# Altium schematic sheet [3]Regulator(+5V&3V3).SchDoc
size A; PageSetup: Record=PageOptions|CenterHorizontal=True|CenterVertical=True|PrintScale=1.00|XCorrection=1.00|YCorrection=1.00|PrintKind=1|BorderSize=5000000|LeftOffset=0|BottomOffset=0|Orientation=1|PaperLength=1000|PaperWidth=1000|Scale=100|PaperSource=7|PrintQuality=-3|MediaType=1|DitherType=10|PrintScaleMode=1|PaperKind=Letter|PaperIndex=1
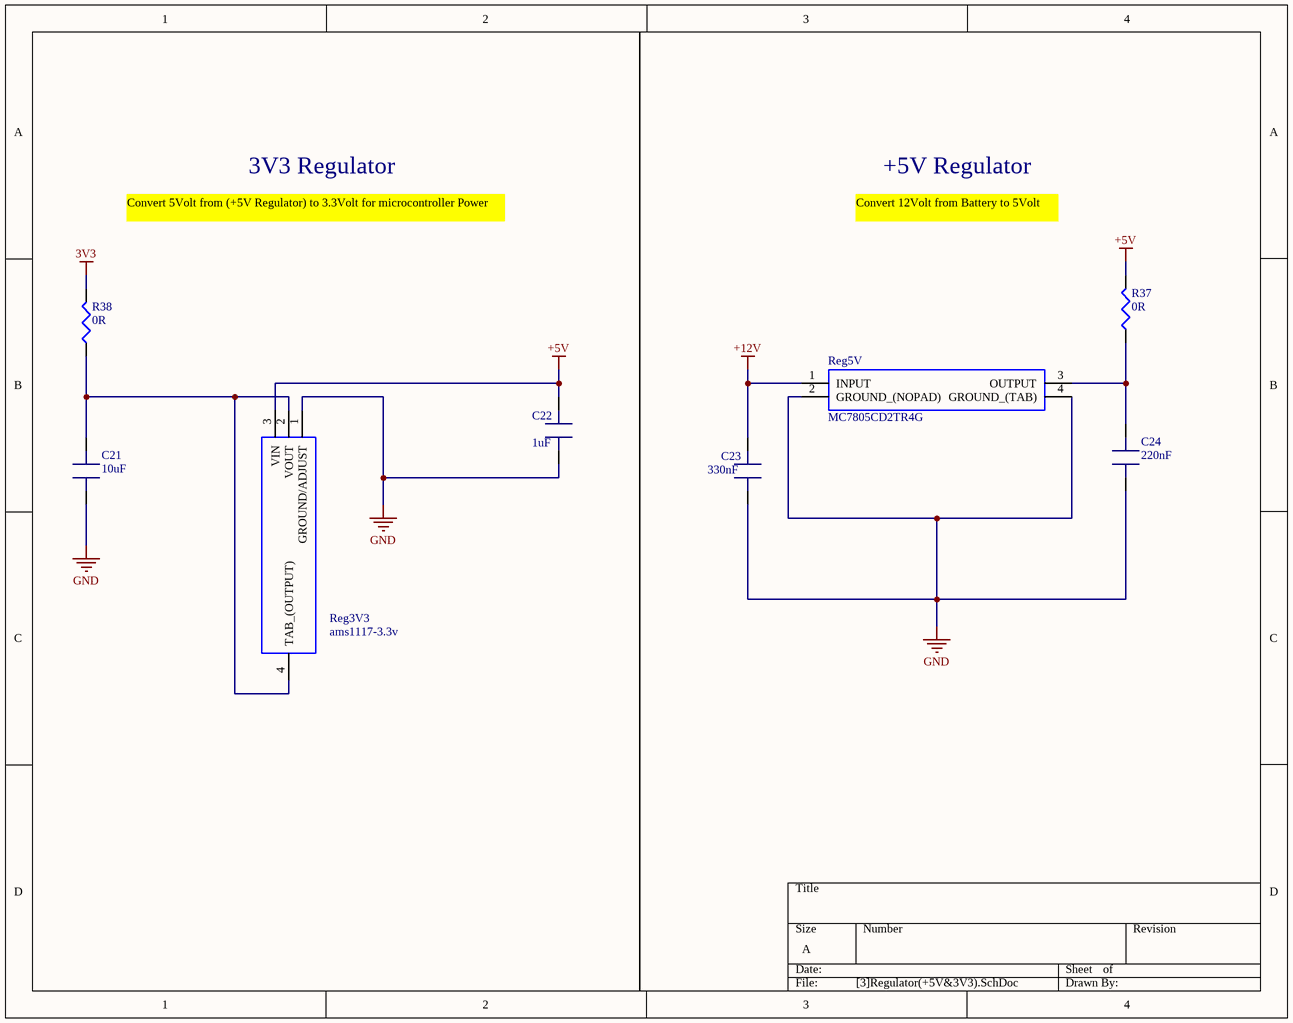
[diagram p0: [3]Regulator(+5V&3V3).SchDoc]

## Parts
C21  10uF  [cap_805]
C22  1uF  [cap_805]
C23  330nF  [cap_805]
C24  220nF  [cap_805]
R37  0R  [Res805]
R38  0R  [Res805]
Reg3V3  ams1117-3.3v  [SOT229P700X180-4N]
Reg5V  MC7805CD2TR4G  [TO254P1420X457-4N]

## Nets
3V3: R38.2
+5V: C22.2 R37.2 Reg3V3.3(VIN)
+12V: C23.2 Reg5V.1(INPUT)
GND: C21.1 C22.1 C23.1 C24.1 Reg3V3.1(GROUND/ADJUST) Reg5V.2(GROUND_(NOPAD)) Reg5V.4(GROUND_(TAB))
NetC21_2: C21.2 R38.1 Reg3V3.2(VOUT) Reg3V3.4(TAB_(OUTPUT))
NetC24_2: C24.2 R37.1 Reg5V.3(OUTPUT)

## Notes on the sheet
- Convert 5Volt from (+5V Regulator) to 3.3Volt for microcontroller Power
- 3V3 Regulator
- Convert 12Volt from Battery to 5Volt
- +5V Regulator

## Library data of the parts
C21-C24 = cap805
R37 R38 = Res805
Reg3V3 = ams1117-3.3v: 1A LOW DROPOUT VOLTAGE REGULATOR, SOT-223; Manufacturer_Name: Advanced Monolithic Systems; Geometry.Height: 1.8mm; Manufacturer_Part_Number: ams1117-3.3v; RS Part Number: *; RS Price/Stock: *; Arrow Part Number: ams1117-3.3v; Arrow Price/Stock: *; Datasheet Link: http://www.advanced-monolithic.com/pdf/ds1117.pdf
Reg5V = MC7805CD2TR4G: Manufacturer_Name: ON Semiconductor; Allied_Number: 70099956; Geometry.Height: 4.572mm; Manufacturer_Part_Number: MC7805CD2TR4G; RS Part Number: 1454706; RS Price/Stock: http://uk.rs-online.com/web/p/products/1454706; Allied Price/Stock: http://www.alliedelec.com/on-semiconductor-mc7805cd2tr4g/70099956/; Arrow Part Number: MC7805CD2TR4G; Arrow Price/Stock: https://www.arrow.com/en/products/mc7805cd2tr4g/on-semiconductor; Datasheet Link: http://www.onsemi.com/pub/Collateral/MC7800-D.PDF